# Altium schematic sheet sheet1.SchDoc
size A4
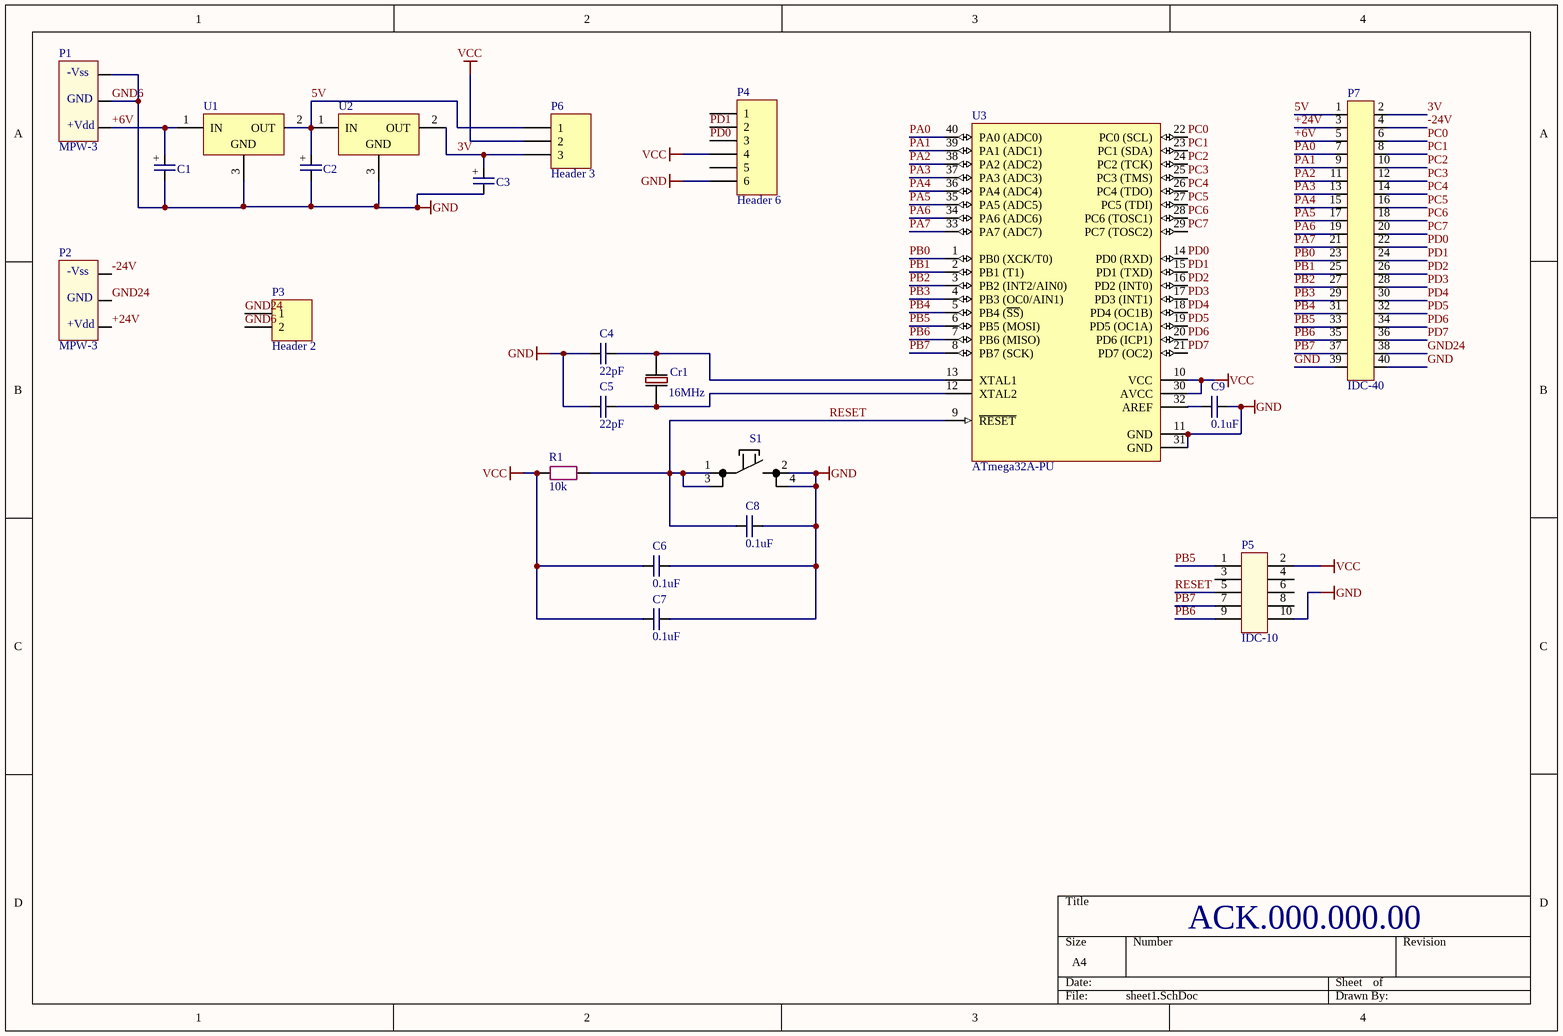
[diagram p0: sheet1.SchDoc]

## Parts
C1  (no value)  [C_TECAP_A]
C2  (no value)  [C_TECAP_A]
C3  (no value)  [C_TECAP_A]
C4  22pF  [C_0805]
C5  22pF  [C_0805]
C6  0.1uF  [C_0805]
C7  0.1uF  [C_0805]
C8  0.1uF  [C_0805]
C9  0.1uF  [C_0805]
Cr1  16MHz  [quarts_2.54]
P1  MPW-3  [MPW-3]
P2  MPW-3  [MPW-3]
P3  Header 2  [HDR1X2]
P4  Header 6  [HDR1X6]
P5  IDC-10  [IDC-10]
P6  Header 3  [HDR1X3]
P7  IDC-40  [IDC-40]
R1  10k  [R_0805]
S1  button 4 pin  [button 4 pin]  (value not drawn)
U1  (no value)  [TO220ABN]
U2  (no value)  [TO220ABN]
U3  ATmega32A-PU  [40P6]

## Nets
GND: C1.2 C2.2 C3.2 C4.1 C5.1 C6.2 C7.2 C8.2 C9.2 P1.1 P1.2 P3.2 P4.6 P5.10 P7.39 P7.40 S1.2 S1.4 U1.3(GND) U2.3(GND) U3.11(GND) U3.31(GND)  [also labelled GND6]
VCC: C6.1 C7.1 P4.4 P5.2 P6.2 R1.1 U3.10(VCC) U3.30(AVCC)
3V: C3.+ P6.3 P7.2 U2.2(OUT)
5V: C2.+ P6.1 P7.1 U1.2(OUT) U2.1(IN)
+6V: C1.+ P1.3 P7.5 U1.1(IN)
+24V: P2.3 P7.3
-24V: P2.1 P7.4
GND24: P2.2 P3.1 P7.38
PA0: P7.7 U3.40(PA0_(ADC0))
PA1: P7.9 U3.39(PA1_(ADC1))
PA2: P7.11 U3.38(PA2_(ADC2))
PA3: P7.13 U3.37(PA3_(ADC3))
PA4: P7.15 U3.36(PA4_(ADC4))
PA5: P7.17 U3.35(PA5_(ADC5))
PA6: P7.19 U3.34(PA6_(ADC6))
PA7: P7.21 U3.33(PA7_(ADC7))
PB0: P7.23 U3.1(PB0_(XCK/T0))
PB1: P7.25 U3.2(PB1_(T1))
PB2: P7.27 U3.3(PB2_(INT2/AIN0))
PB3: P7.29 U3.4(PB3_(OC0/AIN1))
PB4: P7.31 U3.5(PB4_(~{SS}))
PB5: P5.1 P7.33 U3.6(PB5_(MOSI))
PB6: P5.9 P7.35 U3.7(PB6_(MISO))
PB7: P5.7 P7.37 U3.8(PB7_(SCK))
PC0: P7.6 U3.22(PC0_(SCL))
PC1: P7.8 U3.23(PC1_(SDA))
PC2: P7.10 U3.24(PC2_(TCK))
PC3: P7.12 U3.25(PC3_(TMS))
PC4: P7.14 U3.26(PC4_(TDO))
PC5: P7.16 U3.27(PC5_(TDI))
PC6: P7.18 U3.28(PC6_(TOSC1))
PC7: P7.20 U3.29(PC7_(TOSC2))
PD0: P4.3 P7.22 U3.14(PD0_(RXD))
PD1: P4.2 P7.24 U3.15(PD1_(TXD))
PD2: P7.26 U3.16(PD2_(INT0))
PD3: P7.28 U3.17(PD3_(INT1))
PD4: P7.30 U3.18(PD4_(OC1B))
PD5: P7.32 U3.19(PD5_(OC1A))
PD6: P7.34 U3.20(PD6_(ICP1))
PD7: P7.36 U3.21(PD7_(OC2))
RESET: C8.1 P5.5 R1.2 S1.1 S1.3 U3.9(~{RESET})
NetC4_2: C4.2 Cr1.2 U3.13(XTAL1)
NetC5_2: C5.2 Cr1.1 U3.12(XTAL2)
NetC9_1: C9.1 U3.32(AREF)

Not connected (* = marked no-connect by the designer): P4 1 5; P5 3 4 6 8

## Notes on the sheet
- ACK.000.000.00
- (in symbol MPW-3) -Vss; GND; +Vdd

## Library data of the parts
C1-C3 = capacitor_TECAP_SMD_A
C4-C9 = capacitor 0805
Cr1 = quarts_2.54
P3 = Header 2: Header, 2-Pin; LatestRevisionDate: 17-Jul-2002; LatestRevisionNote: Re-released for DXP Platform.; Publisher: Altium Limited
P4 = Header 6: Header, 6-Pin; LatestRevisionDate: 17-Jul-2002; LatestRevisionNote: Re-released for DXP Platform.; Publisher: Altium Limited
P5 = IDC-10: разъем 4130
P6 = Header 3: Header, 3-Pin; LatestRevisionDate: 17-Jul-2002; LatestRevisionNote: Re-released for DXP Platform.; Publisher: Altium Limited
P7 = IDC-40: разъем 2529
R1 = resistor 0805
S1 = button 4 pin2
U1 U2 = L7805ABV: Precision 1A Regulator; Note: Tab is connected to pin 3 (GND).; Published: 24-Aug-2001; LatestRevisionDate: 17-Jul-2002; LatestRevisionNote: Re-released for DXP Platform.; DatasheetVersion: Nov-1999; PackageVersion: Jun-1998; PackageReference: TO220ABN; Publisher: Altium Limited; PackageDescription: TO, Thru-Hole, Vertical, Heatsink Mounted; 3 In-Line Leads; Pitch 2.54 mm; Pin sequence 1, 3, 2; ComponentLink1Description: Manufacturer Link; ComponentLink1URL: http://www.st.com/; ComponentLink2Description: Datasheet; ComponentLink2URL: http://www.st.com/stonline/products/literature/ds/2144/l7805ab.pdf
U3 = ATmega32A-PU: 8-bit AVR Microcontroller, 32KB Flash, 1KB EEPROM, 2KB SRAM, 40-pin PDIP, Industrial Grade (-40°C to 85°C); Published: 1-Apr-2010; DatasheetVersion: revB, Jul-2009; PackageVersion: revB, Sep-2001; PackageReference: 40P6; Publisher: Altium Limited; PackageDescription: 40-lead (0.600"/15.24mm Wide) Plastic Dual Inline Package (PDIP); Supplier 1: Digi-Key; Supplier Part Number 1: ATMEGA32A-PU-ND; Supplier 2: Farnell; Supplier Part Number 2: 1704565; Supplier 3: Mouser; Supplier Part Number 3: 556-ATMEGA32A-PU; Code_JEDEC: MS-011-AC; ComponentLink1Description: Manufacturer Link; ComponentLink1URL: http://www.atmel.com/products/avr/default.asp?; ComponentLink2Description: ATmega32A Datasheet; ComponentLink2URL: http://www.atmel.com/dyn/resources/prod_documents/doc8155.pdf; ComponentLink3Description: ATmega32A Summary; ComponentLink3URL: http://www.atmel.com/dyn/resources/prod_documents/8155S.pdf; ComponentLink4Description: Atmel.com Home; ComponentLink4URL: http://www.atmel.com